# EAGLE design NuTube_Screamer_v1_1 (EAGLE 6.3)

## Sheet 1 of 2
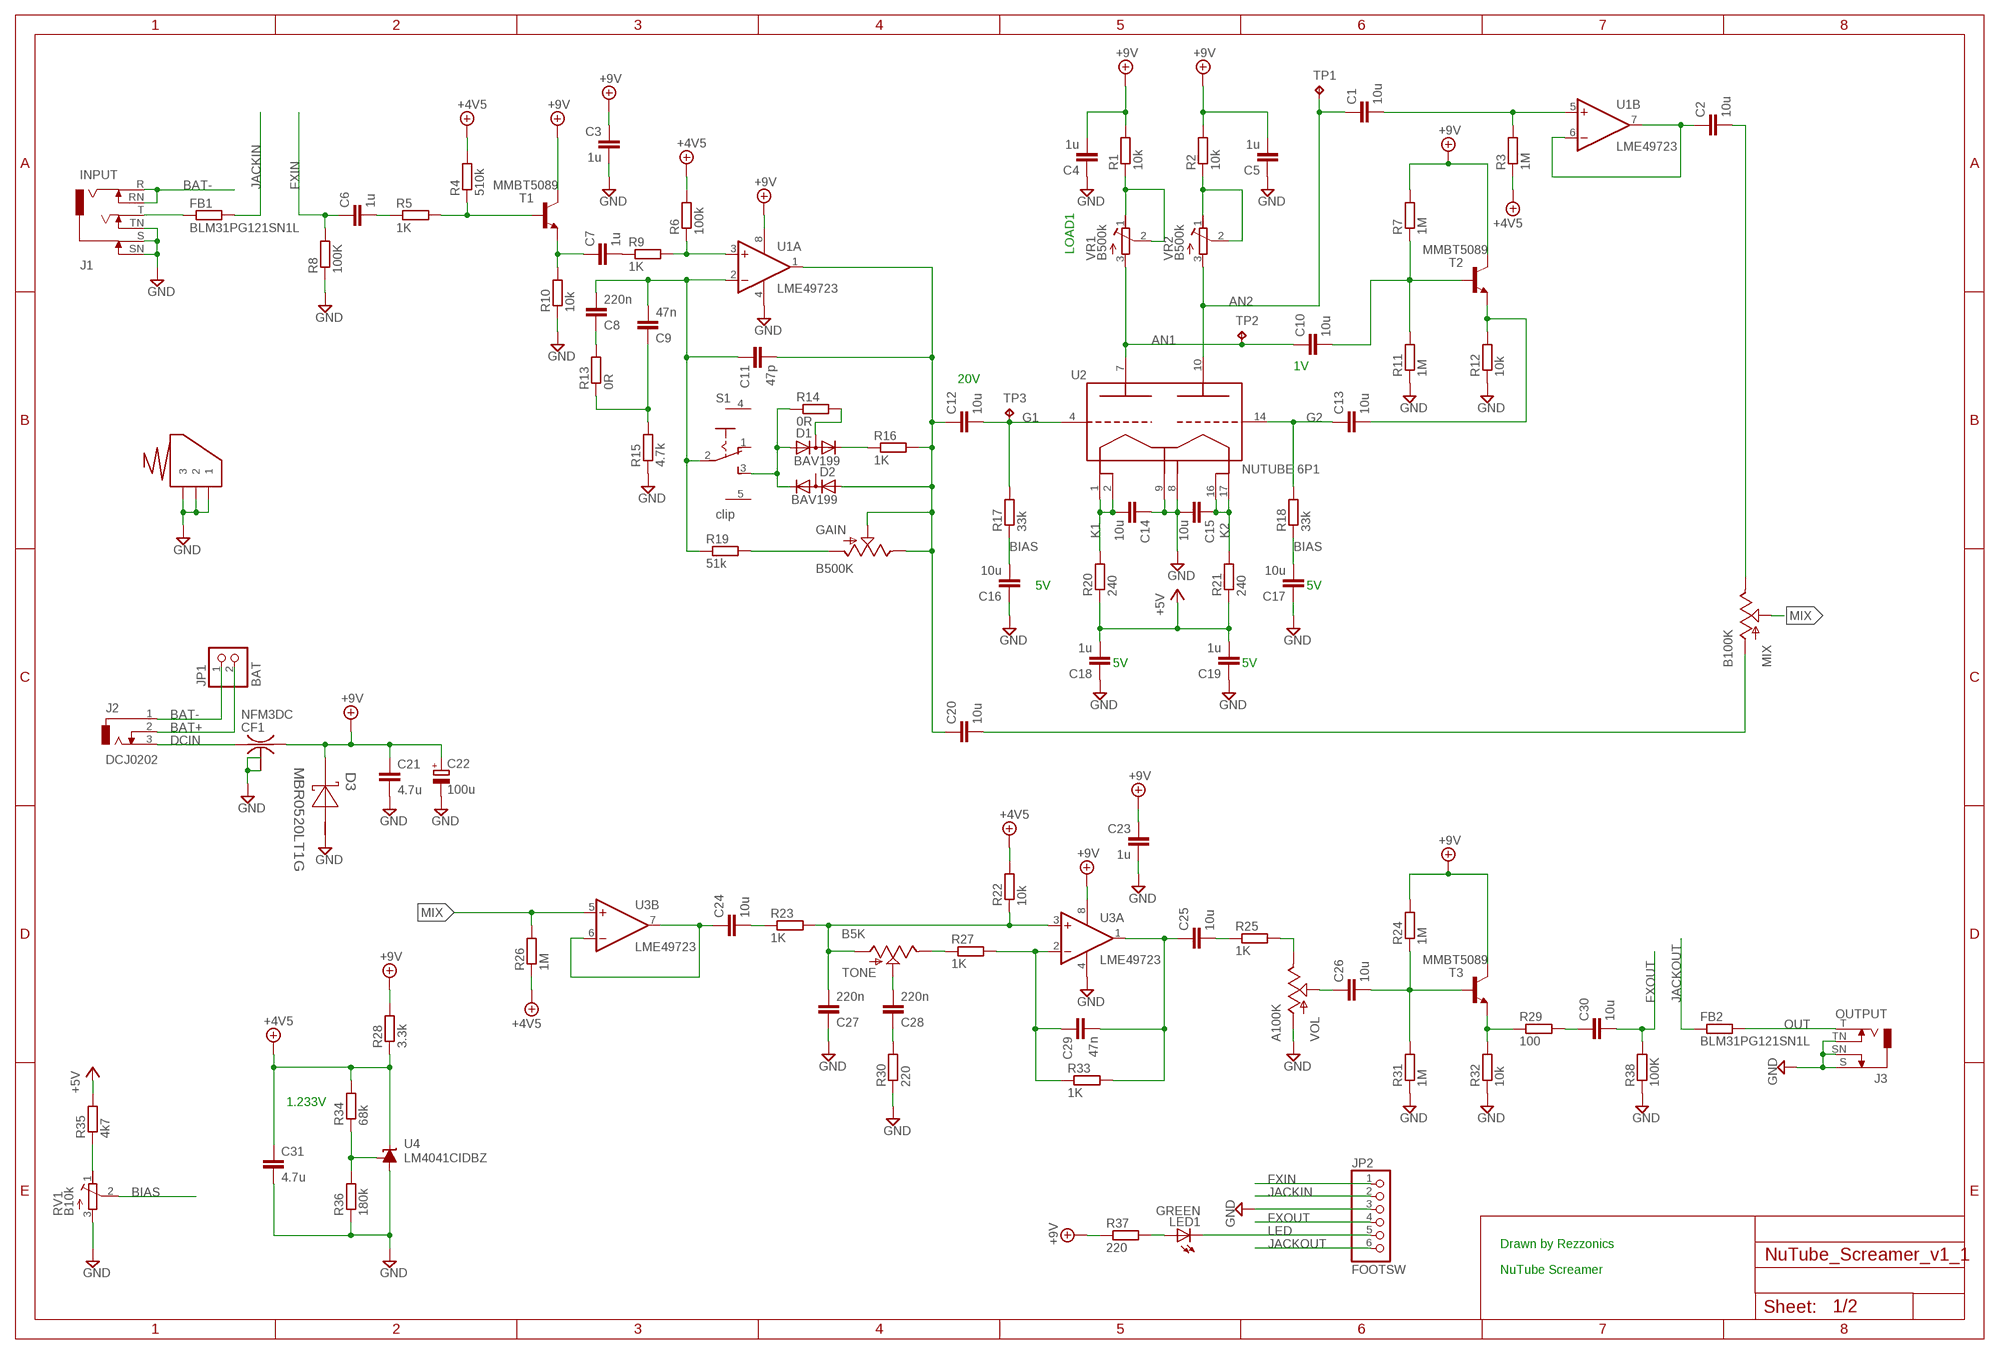
[diagram p0: schematic, sheet 1]

### Parts
C1  10u  C-EUC0805K  [C0805K]
C2  10u  C-EUC0805K  [C0805K]
C3  1u  C-EUC0603K  [C0603K]
C4  1u  C-EUC0603K  [C0603K]
C5  1u  C-EUC0603K  [C0603K]
C6  1u  C-EUC0603K  [C0603K]
C7  1u  C-EUC0603K  [C0603K]
C8  220n  C-EUC0603K  [C0603K]
C9  47n  C-EUC0603K  [C0603K]
C10  10u  C-EUC0805K  [C0805K]
C11  47p  C-EUC0603K  [C0603K]
C12  10u  C-EUC0805K  [C0805K]
C13  10u  C-EUC0805K  [C0805K]
C14  10u  C-EUC0805K  [C0805K]
C15  10u  C-EUC0805K  [C0805K]
C16  10u  C-EUC0805K  [C0805K]
C17  10u  C-EUC0805K  [C0805K]
C18  1u  C-EUC0603K  [C0603K]
C19  1u  C-EUC0603K  [C0603K]
C20  10u  C-EUC0805K  [C0805K]
C21  4.7u  C-EUC0805K  [C0805K]
C22  100u  CPOL-EUD  [PANASONIC_D]
C23  1u  C-EUC0603K  [C0603K]
C24  10u  C-EUC0805K  [C0805K]
C25  10u  C-EUC0805K  [C0805K]
C26  10u  C-EUC0805K  [C0805K]
C27  220n  C-EUC0603K  [C0603K]
C28  220n  C-EUC0603K  [C0603K]
C29  47n  C-EUC0603K  [C0603K]
C30  10u  C-EUC0805K  [C0805K]
C31  4.7u  C-EUC0805K  [C0805K]
CF1  NFM3DC  [NFM3DC]
D1  BAV199  [SOT23]
D2  BAV199  [SOT23]
D3  MBR0520LT1G  MBR0540T1G  [SOD-123]
FB1  BLM31PG121SN1L  R-EU_R1206  [R1206]
FB2  BLM31PG121SN1L  R-EU_R1206  [R1206]
GAIN  B500K  POT  [ALPS_POT]
J1  INPUT  STEREOSW3C  [NEUTRIK-NMJ6HCD2]
J2  DCJ0202  [DCJ0202]
J3  OUTPUT  MONOSW3C  [NEUTRIK-NMJ4HCD2]
JP1  BAT  PINHD-1X2  [1X02]
JP2  FOOTSW  PINHD-1X6  [1X06]
LED1  GREEN  LED5MM  [LED5MM]
MIX  B100K  POT  [ALPS_POT]
R1  10k  R-EU_R0603  [R0603]
R2  10k  R-EU_R0603  [R0603]
R3  1M  R-EU_R0603  [R0603@1]
R4  510k  R-EU_R0603  [R0603@1]
R5  1K  R-EU_R0603  [R0603@1]
R6  100k  R-EU_R0603  [R0603@1]
R7  1M  R-EU_R0603  [R0603@1]
R8  100K  R-EU_R0603  [R0603@1]
R9  1K  R-EU_R0603  [R0603@1]
R10  10k  R-EU_R0603  [R0603@1]
R11  1M  R-EU_R0603  [R0603@1]
R12  10k  R-EU_R0603  [R0603@1]
R13  0R  R-EU_R0603  [R0603@1]
R14  0R  R-EU_R0603  [R0603@1]
R15  4.7k  R-EU_R0603  [R0603@1]
R16  1K  R-EU_R0603  [R0603@1]
R17  33k  R-EU_R0603  [R0603]
R18  33k  R-EU_R0603  [R0603]
R19  51k  R-EU_R0603  [R0603@1]
R20  240  R-EU_R0603  [R0603]
R21  240  R-EU_R0603  [R0603]
R22  10k  R-EU_R0603  [R0603@1]
R23  1K  R-EU_R0603  [R0603@1]
R24  1M  R-EU_R0603  [R0603@1]
R25  1K  R-EU_R0603  [R0603@1]
R26  1M  R-EU_R0603  [R0603@1]
R27  1K  R-EU_R0603  [R0603@1]
R28  3.3k  R-EU_R0603  [R0603@1]
R29  100  R-EU_R0603  [R0603@1]
R30  220  R-EU_R0603  [R0603@1]
R31  1M  R-EU_R0603  [R0603@1]
R32  10k  R-EU_R0603  [R0603@1]
R33  1K  R-EU_R0603  [R0603@1]
R34  68k  R-EU_R0603  [R0603@1]
R35  4k7  R-EU_R0603  [R0603]
R36  180k  R-EU_R0603  [R0603@1]
R37  220  R-EU_R0603  [R0603@1]
R38  100K  R-EU_R0603  [R0603@1]
RV1  B10k  R-TRIMM3314G  [RTRIM3314G]
S1  clip  SPDT  [MHS122K]
T1  MMBT5089  MMBT2222ALT1-NPN-SOT23-BEC  [SOT23-BEC]
T2  MMBT5089  MMBT2222ALT1-NPN-SOT23-BEC  [SOT23-BEC]
T3  MMBT5089  MMBT2222ALT1-NPN-SOT23-BEC  [SOT23-BEC]
TONE  B5K  POT  [ALPS_POT]
TP1  TPTP10R  [TP10R]
TP2  TPTP10R  [TP10R]
TP3  TPTP10R  [TP10R]
U1  LME49723  RC4559D  [SO08]
U2  NUTUBE 6P1  NUTUBE_6P1_1  [NUTUBE_6P1_1]
U3  LME49723  RC4559D  [SO08]
U4  LM4041CIDBZ  [DBZ_R-PDSO-G3]
VOL  A100K  POT  [ALPS_POT]
VR1  B500k  R-TRIMM3314G  [RTRIM3314G]
VR2  B500k  R-TRIMM3314G  [RTRIM3314G]
X1  CLIPAAA-CLIPAAA_2  [CLIPAAA_2]

### Nets
+4.5V [PWR]: C31.1 R3.1 R4.2 R6.2 R22.2 R26.1 R28.1 R34.2 U4.2(C) ; supply symbol labelled +4V5
+5V [PWR]: C18.2 C19.2 R20.1 R21.1 R35.2 ; also sheet 2
+9V [PWR]: C3.1 C4.2 C5.2 C21.1 C22.+ C23.1 CF1.3 D3.1(K) R1.2 R2.2 R7.2 R24.2 R28.2 R37.1 T1.C T2.C T3.C U1.8(P:V+) U3.8(P:V+) ; also sheet 2
AN1: C10.1 TP2.TP U2.7(A1_7) VR1.3(A)
AN2: C1.1 TP1.TP U2.10(A2_10) VR2.3(A)
BAT+ [PWR]: J2.2 JP1.2
BAT- [PWR]: J1.R J1.RN J2.1 JP1.1
BIAS: C16.2 C17.2 R17.1 R18.1 RV1.2(S)
DCIN [PWR]: CF1.1 J2.3
FXIN: C6.1 JP2.1 R8.2
FXOUT: C30.2 JP2.4 R38.2
G1: C12.2 R17.2 TP3.TP U2.4(G1_4)
G2: C13.1 R18.2 U2.14(G2_14)
GND [PWR]: C3.2 C4.1 C5.1 C14.1 C15.2 C16.1 C17.1 C18.1 C19.1 C21.2 C22.- C23.2 C27.1 C31.2 CF1.2@1 CF1.2@2 D3.2(A) J1.S J1.SN J1.TN J3.S J3.SN J3.TN JP2.3 R8.1 R10.1 R11.1 R12.1 R15.1 R30.1 R31.1 R32.1 R36.1 R38.1 RV1.3(A) U1.4(P:V-) U2.8(GND_8) U2.9(F2_9) U3.4(P:V-) U4.3(A) VOL.P$1(A) X1.1 X1.2 X1.3 ; also sheet 2
JACKIN: FB1.2 JP2.2
JACKOUT: FB2.1 JP2.6
K1: C14.2 R20.2 U2.1(F1_1) U2.2(F1_2)
K2: C15.1 R21.2 U2.16(F3_16) U2.17(F3_17)
LED: JP2.5 LED1.K(C)
MIX: MIX.P$2(S) R26.2 U3.5(B:+IN)
N$1: C10.2 R7.1 R11.2 T2.B
N$2: C6.2 R5.1
N$3: C13.2 R12.2 T2.E
N$4: FB1.1 J1.T
N$6: C7.1 R10.2 T1.E
N$7: R4.1 R5.2 T1.B
N$8: C7.2 R9.1
N$9: R6.1 R9.2 U1.3(A:+IN)
N$10: D1.2(C) R16.1
N$11: D1.1(A) D2.2(C) R14.1 S1.3(S)
N$12: D1.3(AC) R14.2
N$13: C11.2 C12.1 C20.1 D2.1(A) GAIN.P$2(S) GAIN.P$3(E) R16.2 U1.1(A:OUT)
N$14: C8.2 C9.2 C11.1 R19.1 S1.2(P) U1.2(A:-IN)
N$17: GAIN.P$1(A) R19.2
N$18: R34.1 R36.2 U4.1(FB)
N$19: LED1.A R37.2
N$20: C8.1 R13.2
N$21: R35.1 RV1.1(E)
N$22: C9.1 R13.1 R15.2
N$24: C1.2 R3.2 U1.5(B:+IN)
N$25: C2.1 U1.6(B:-IN) U1.7(B:OUT)
N$26: C20.2 MIX.P$1(A)
N$27: C2.2 MIX.P$3(E)
N$28: C27.2 R22.1 R23.2 TONE.P$1(A) U3.3(A:+IN)
N$29: C24.1 U3.6(B:-IN) U3.7(B:OUT)
N$30: C24.2 R23.1
N$31: C25.1 C29.2 R33.2 U3.1(A:OUT)
N$32: R27.1 TONE.P$3(E)
N$33: C28.2 TONE.P$2(S)
N$34: C28.1 R30.2
N$35: C29.1 R27.2 R33.1 U3.2(A:-IN)
N$36: C25.2 R25.1
N$37: R25.2 VOL.P$3(E)
N$38: C26.1 VOL.P$2(S)
N$39: C26.2 R24.1 R31.2 T3.B
N$40: R29.1 R32.2 T3.E
N$41: C30.1 R29.2
OUT: FB2.2 J3.T
RL1: R1.1 VR1.1(E) VR1.2(S)
RL2: R2.1 VR2.1(E) VR2.2(S)
Unconnected: D2.3(AC) S1.1(O) S1.4(G1) S1.5(G2)

### Notes on the sheet
- LOAD1
- 1V
- 20V
- 5V | 5V
- 5V | 5V
- 1.233V
- Drawn by Rezzonics
- NuTube Screamer

## Sheet 2 of 2
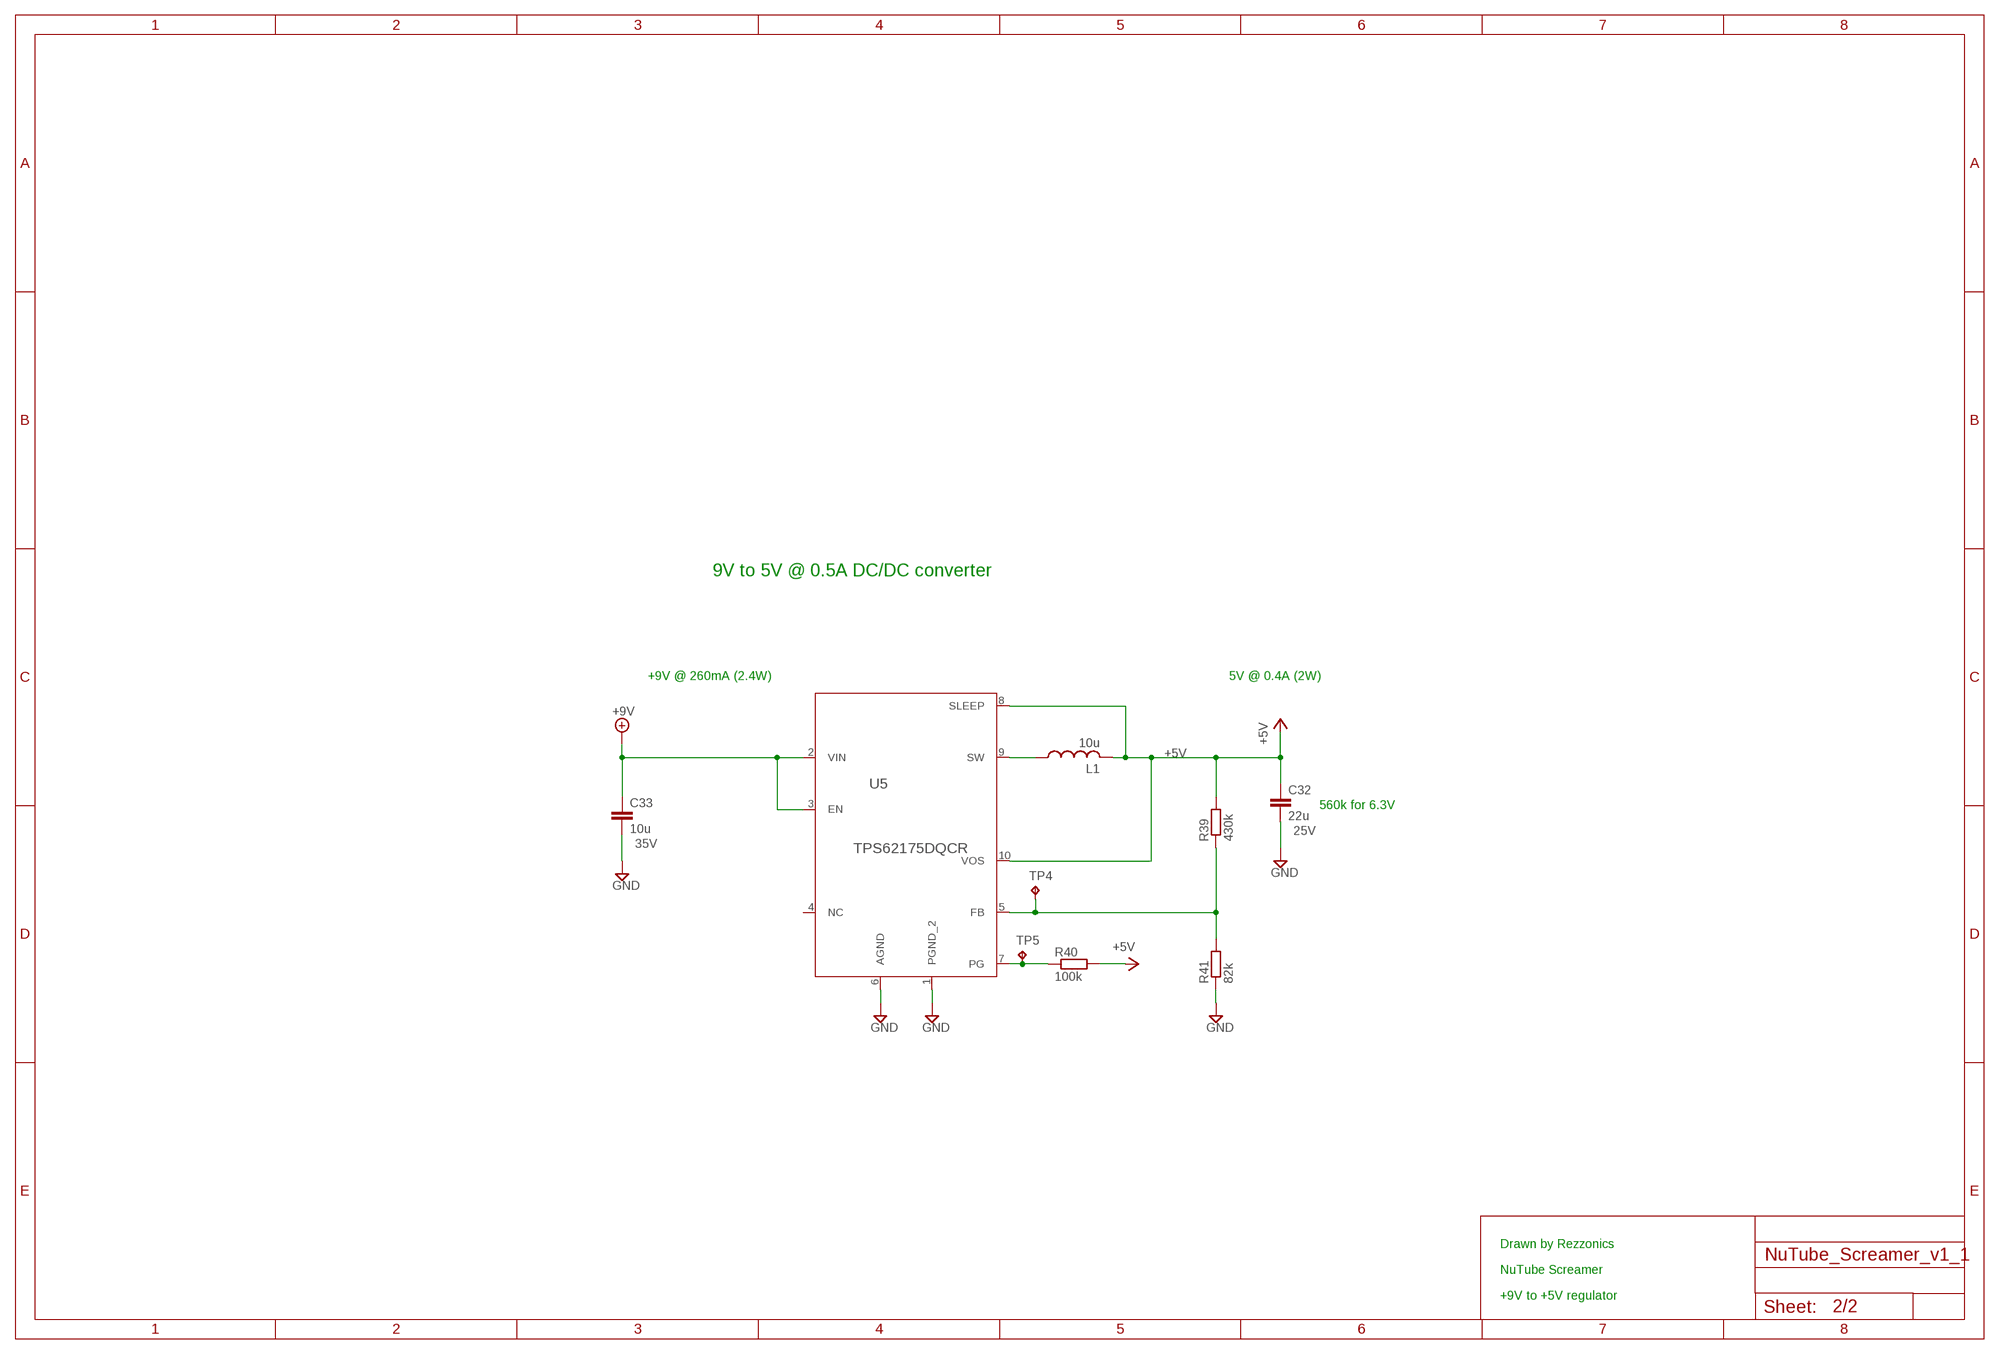
[diagram p1: schematic, sheet 2]

### Parts
C32  22u  C-EUC0805K  [C0805K]
C33  10u  C-EUC0805K  [C0805K]
L1  10u  SRN4018  [SRN4018]
R39  430k  R-EU_R0603  [R0603]
R40  100k  R-EU_R0603  [R0603]
R41  82k  R-EU_R0603  [R0603]
TP4  TPTP10R  [TP10R]
TP5  TPTP10R  [TP10R]
U5  TPS62175DQCR  [R-PWSON-N10]

### Nets
+5V [PWR]: C32.1 L1.2 R39.2 R40.2 U5.8(SLEEP) U5.10(VOS) ; also sheet 1
+9V [PWR]: C33.1 U5.2(VIN) U5.3(EN) ; also sheet 1
GND [PWR]: C32.2 C33.2 R41.1 U5.1(PGND_2) U5.6(AGND) ; also sheet 1
N$15: R40.1 TP5.TP U5.7(PG)
N$23 [PWR]: L1.1 U5.9(SW)
VCC3: R39.1 R41.2 TP4.TP U5.5(FB)
Unconnected: U5.4(NC)

### Notes on the sheet
- 9V to 5V @ 0.5A DC/DC converter
- +9V @ 260mA (2.4W) | 5V @ 0.4A (2W)
- 560k for 6.3V
- Drawn by Rezzonics
- NuTube Screamer
- +9V to +5V regulator

## Library data of the parts
C1 C2 C10 C12 C14-C17 C20 C24-C26 C30 = rcl:C-EU: CAPACITOR, European symbol; MPN: GRM21BR6YA106KE43L; PARTNO: GRM21BR6YA106KE43L
C3 C6 C7 C23 = rcl:C-EU: CAPACITOR, European symbol; MPN: GRM188R71H104KA93D; PARTNO: C1608X7R1V105K080AE
C4 C5 C18 C19 = rcl:C-EU: CAPACITOR, European symbol; MPN: C1608X5R1H105K080AB; PARTNO: C1608X7R1V105K080AE
C8 C27 C28 = rcl:C-EU: CAPACITOR, European symbol; MPN: GRM188R71H104KA93D; PARTNO: GRM188R61H224KAC4D
C9 C29 = rcl:C-EU: CAPACITOR, European symbol; MPN: GRM188R71H104KA93D; PARTNO: 06035D473MAT2A
C11 = rcl:C-EU: CAPACITOR, European symbol; MPN: GRM188R71H104KA93D; PARTNO: GCM1885C2A470JA16D
C13 = rcl:C-EU: CAPACITOR, European symbol; PARTNO: GRM21BR6YA106KE43L
C21 C31 = rcl:C-EU: CAPACITOR, European symbol; MPN: GRM21BR61E475KA12L; PARTNO: C2012X5R1E475K125AB
C22 = rcl:CPOL-EU: POLARIZED CAPACITOR, European symbol; MPN: EEE-1VA101XP; PARTNO: EEE-1VA101XP
C32 = rcl:C-EU: CAPACITOR, European symbol; MPN: C2012X5R1V226M125AC; PARTNO: C2012X5R1V226M125AC; VOLT: 25V
C33 = rcl:C-EU: CAPACITOR, European symbol; MPN: GRM21BR6YA106KE43L; PARTNO: GRM21BR6YA106KE43L; VOLT: 35V
CF1 = murata-filter:NFM: EMIFIL(R) (Capacitor type) Single Circuit Type for Signal Lines Source: http://search.murata.co.jp/Ceramy/image/img/PDF/ENG/L0111S0109NFM3DC.pdf; MF: FARNELL; MPN: NFM3DPC223R1H3L; OC_FARNELL: 9528288; OC_NEWARK: 38K6023; PARTNO: NFM3DPC223R1H3L
D1 D2 = diode:BAV199: DIODE low-leakage double diode; PARTNO: BAV199235
D3 = rezzonics:MBR0540T1G; DATASHEETURL: http://www.onsemi.com/pub%5Flink/Collateral/MBR0540T1%2DD.PDF; IO: 0.5; MANUFACTURER_NAME: ON Semiconductor; MANUFACTURER_PART_NUMBER: MBR0540T1G; MPN: MBR0520LT1G; PARTNO: MBR0520LT1G; VENDOR: ON Semiconductor; VFATIO: 0.51; VRRM: 40.0
FB1 FB2 = rcl:R-EU_: RESISTOR, European symbol; MPN: BLM31PG121SN1L; PARTNO: BLM31PG121SN1L
GAIN = rezzonics:POT; PARTNO: PTV09A-4020S-B504
J1 = audio jacks 0.25 inch:STEREOSW3C: 1/4" stereo jack, switched, with chrome ferrule and straight PCB pins, mounting nut included; MPN: NMJ6HCD2; PARTNO: NMJ6HCD2
J2 = con-jack:DCJ0202: DC POWER JACK Source: DCJ0202.pdf; MPN: 163-179PH-EX; OC_FARNELL: unknown; OC_NEWARK: unknown; PARTNO: PJ-202A
J3 = audio jacks 0.25 inch:MONOSW3C: 1/4" mono jack, switched, with chrome ferrule and straight PCB pins, mounting nut included; MPN: NMJ4HCD2; PARTNO: NMJ4HCD2
JP1 = pinhead:PINHD-1X2: PIN HEADER; MPN: *; PARTNO: *
JP2 = pinhead:PINHD-1X6: PIN HEADER; MPN: *; PARTNO: *
L1 = rezzonics:SRN4018: SRN4018 <http://www.bourns.com/docs/Product-Datasheets/SRN4018.pdf>; MPN: SRN4018-100M; PARTNO: SRN4018-100M
LED1 = led:LED: LED OSRAM: - CHIPLED LG R971, LG N971, LY N971, LG Q971, LY Q971, LO R971, LY R971 LH N974, LH R974 LS Q976, LO Q976, LY Q976 LO Q996 - Hyper CHIPLED LW Q18S LB Q993, LB Q99A, LB R99A - SideLED LS A670, LO A670, LY A670, LG A670, LP A670 LB A673, LV A673, LT A673, LW A673 LH A674 LY A675 LS A676, LA A676, LO A676, LY A676, LW A676 LS A679, LY A679, LG A679 - Hyper Micro SIDELED® LS Y876, LA Y876, LO Y876, LY Y876 LT Y87S - SmartLED LW L88C, LW L88S LB L89C, LB L89S, LG L890 LS L89K, LO L89K, LY L89K LS L896, LA L896, LO L896, LY L896 - TOPLED LS T670, LO T670, LY T670, LG T670, LP T670 LSG T670, LSP T670, LSY T670, LOP T670, LYG T670 LG T671, LOG T671, LSG T671 LB T673, LV T673, LT T673, LW T673 LH T674 LS T676, LA T676, LO T676, LY T676, LB T676, LH T676, LSB T676, LW T676 LB T67C, LV T67C, LT T67C, LS T67K, LO T67K, LY T67K, LW E67C LS E67B, LA E67B, LO E67B, LY E67B, LB E67C, LV E67C, LT E67C LW T67C LS T679, LY T679, LG T679 LS T770, LO T770, LY T770, LG T770, LP T770 LB T773, LV T773, LT T773, LW T773 LH T774 LS E675, LA E675, LY E675, LS T675 LS T776, LA T776, LO T776, LY T776, LB T776 LHGB T686 LT T68C, LB T68C - Hyper Mini TOPLED® LB M676 - Mini TOPLED Santana® LG M470 LS M47K, LO M47K, LY M47K Source: http://www.osram.convergy.de LUXEON: - LUMILED® LXK2-PW12-R00, LXK2-PW12-S00, LXK2-PW14-U00, LXK2-PW14-V00 LXK2-PM12-R00, LXK2-PM12-S00, LXK2-PM14-U00 LXK2-PE12-Q00, LXK2-PE12-R00, LXK2-PE12-S00, LXK2-PE14-T00, LXK2-PE14-U00 LXK2-PB12-K00, LXK2-PB12-L00, LXK2-PB12-M00, LXK2-PB14-N00, LXK2-PB14-P00, LXK2-PB14-Q00 LXK2-PR12-L00, LXK2-PR12-M00, LXK2-PR14-Q00, LXK2-PR14-R00 LXK2-PD12-Q00, LXK2-PD12-R00, LXK2-PD12-S00 LXK2-PH12-R00, LXK2-PH12-S00 LXK2-PL12-P00, LXK2-PL12-Q00, LXK2-PL12-R00 Source: www.luxeon.com KINGBRIGHT: KA-3528ASYC Source: www.kingbright.com; MPN: SSL-LX5093GD; PARTNO: SSL-LX5093GD
MIX = rezzonics:POT; PARTNO: PTV09A-4020S-B104
R1 R2 = resistor:R-EU_: RESISTOR, European symbol; MPN: ERJ-2RKF1002X; PARTNO: CR0603-FX-1002HLF
R3 R7 R8 R11 R24 R26 R31 R38 = rcl:R-EU_: RESISTOR, European symbol; MPN: CR0603-FX-1004ELF; PARTNO: CR0603-FX-1004ELF
R4 = rcl:R-EU_: RESISTOR, European symbol; MPN: CR0603-FX-1004ELF; PARTNO: CR0603-FX-5103ELF
R5 R9 R16 R23 R25 R27 R33 = rcl:R-EU_: RESISTOR, European symbol; MPN: CR0603-FX-1002HLF; PARTNO: ERJ-3EKF1001V
R6 = rcl:R-EU_: RESISTOR, European symbol; MPN: CR0603-FX-1004ELF; PARTNO: ERJ-3EKF1003V
R10 R12 R22 R32 = rcl:R-EU_: RESISTOR, European symbol; MPN: CR0603-FX-1004ELF; PARTNO: CR0603-FX-1002HLF
R13 R14 = rcl:R-EU_: RESISTOR, European symbol; MPN: CR0603-FX-1002HLF; PARTNO: CRCW06030000ZSTB
R15 = rcl:R-EU_: RESISTOR, European symbol; MPN: CR0603-FX-1004ELF; PARTNO: ERJ-3EKF4701V
R17 R18 = resistor:R-EU_: RESISTOR, European symbol; MPN: ERJ-2RKF3302X; PARTNO: CR0603-FX-3302ELF
R19 = rcl:R-EU_: RESISTOR, European symbol; MPN: CR0603-FX-1002HLF; PARTNO: ERJ-3EKF5102V
R20 R21 = resistor:R-EU_: RESISTOR, European symbol; MPN: ERJ-3EKF2400V; PARTNO: ERJ-3EKF2400V
R28 = rcl:R-EU_: RESISTOR, European symbol; MPN: RC0603FR-073K3L; PARTNO: RC0603FR-073K3L
R29 = rcl:R-EU_: RESISTOR, European symbol; MPN: CR0603-FX-1002HLF; PARTNO: RC0603FR-07100RL
R30 = rcl:R-EU_: RESISTOR, European symbol; MPN: CR0603-FX-1004ELF; PARTNO: ERJ-PA3F2200V
R34 = rcl:R-EU_: RESISTOR, European symbol; MPN: RC0603FR-0768KL; PARTNO: RC0603FR-0768KL
R35 = resistor:R-EU_: RESISTOR, European symbol; MPN: ERJ-2RKF4701X; PARTNO: ERJ-3EKF4701V
R36 = rcl:R-EU_: RESISTOR, European symbol; MPN: RC0603FR-07180KL; PARTNO: RC0603FR-07180KL
R37 = rcl:R-EU_: RESISTOR, European symbol; MPN: ERJ-PA3F2200V; PARTNO: ERJ-PA3F2200V
R39 = resistor:R-EU_: RESISTOR, European symbol; MPN: ERJ-2GEJ434X; PARTNO: CR0603-FX-4303ELF
R40 = resistor:R-EU_: RESISTOR, European symbol; MPN: ERJ-2RKF1003X; PARTNO: ERJ-3EKF1003V
R41 = resistor:R-EU_: RESISTOR, European symbol; MPN: ERJ-2RKF8202X; PARTNO: ERJ-3EKF8202V
RV1 = rcl:R-TRIMM: Trimm resistor; MPN: 3314G-2-103E; PARTNO: 3314G-2-103E
S1 = rezzonics:SPDT: SPDT SLIDING SWITCH 4mm spacing through hole, vertical SPDT slide switch APEM MHS122K <http://www.apem.com/files/apem/brochures/MHS_MINI_SLIDE.pdf>; PARTNO: MHS122K
T1-T3 = transistor-neu-to92:*-NPN-: NPN Transistror; PARTNO: MMBT5089
TONE = rezzonics:POT; PARTNO: PTV09A-4020F-B502
TP1-TP5 = testpad:TP: Test pad; MPN: *; PARTNO: 1249
U1 U3 = linear:RC4559: OP AMP; MPN: LME49723MA/NOPB; PARTNO: LME49723MA/NOPB
U2 = rezzonics:NUTUBE_6P1: NUTUBE 6P1 Twin Triode Datasheet <http://nutube.us/downloads/Nutube_Datasheet_31.pdf>; MPN: *; PARTNO: 831-87-032-10-001101
U4 = texas:LM4041*I: PRECISION MICROPOWER SHUNT VOLTAGE REFERENCE Adjustable Output Source: http://focus.ti.com/lit/ds/slcs146e/slcs146e.pdf; MF: TEXAS INSTRUMENT CONNECTORS; MPN: LM4041CIDBZR; OC_FARNELL: unknown; OC_NEWARK: 31K7136; PARTNO: LM4041CIDBZR
U5 = rezzonics:TPS62175DQCR; DATASHEETURL: httpwww.ti.comproducttps62175; FREQUENCY: 1000000.0; IMAX: 0.5; MANUFACTURER_NAME: Texas Instruments; MANUFACTURER_PART_NUMBER: TPS62175DQCR; MKTG_PACKAGE: TPS62175; MPN: TPS62175DQCR; NSID: TPS62175DQCR; PACKAGE: TPS62175; PARTNO: TPS62175DQCR; VENDOR: Texas Instruments
VOL = rezzonics:POT; PARTNO: PTV09A-4020S-A104
VR1 VR2 = rcl:R-TRIMM: Trimm resistor; MPN: 3314G-1-504E; PARTNO: 3314G-1-504E
X1 = battery:CLIPAAA-: Clip battery AAA Negative Spring Keystone 629; MPN: 591; PARTNO: 591

## Net classes
0 default: width 0.25 mm, drill 0.5 mm, clearance 0.25 mm
1 PWR: width 0.25 mm, drill 0.5 mm, clearance 0.25 mm

## Board
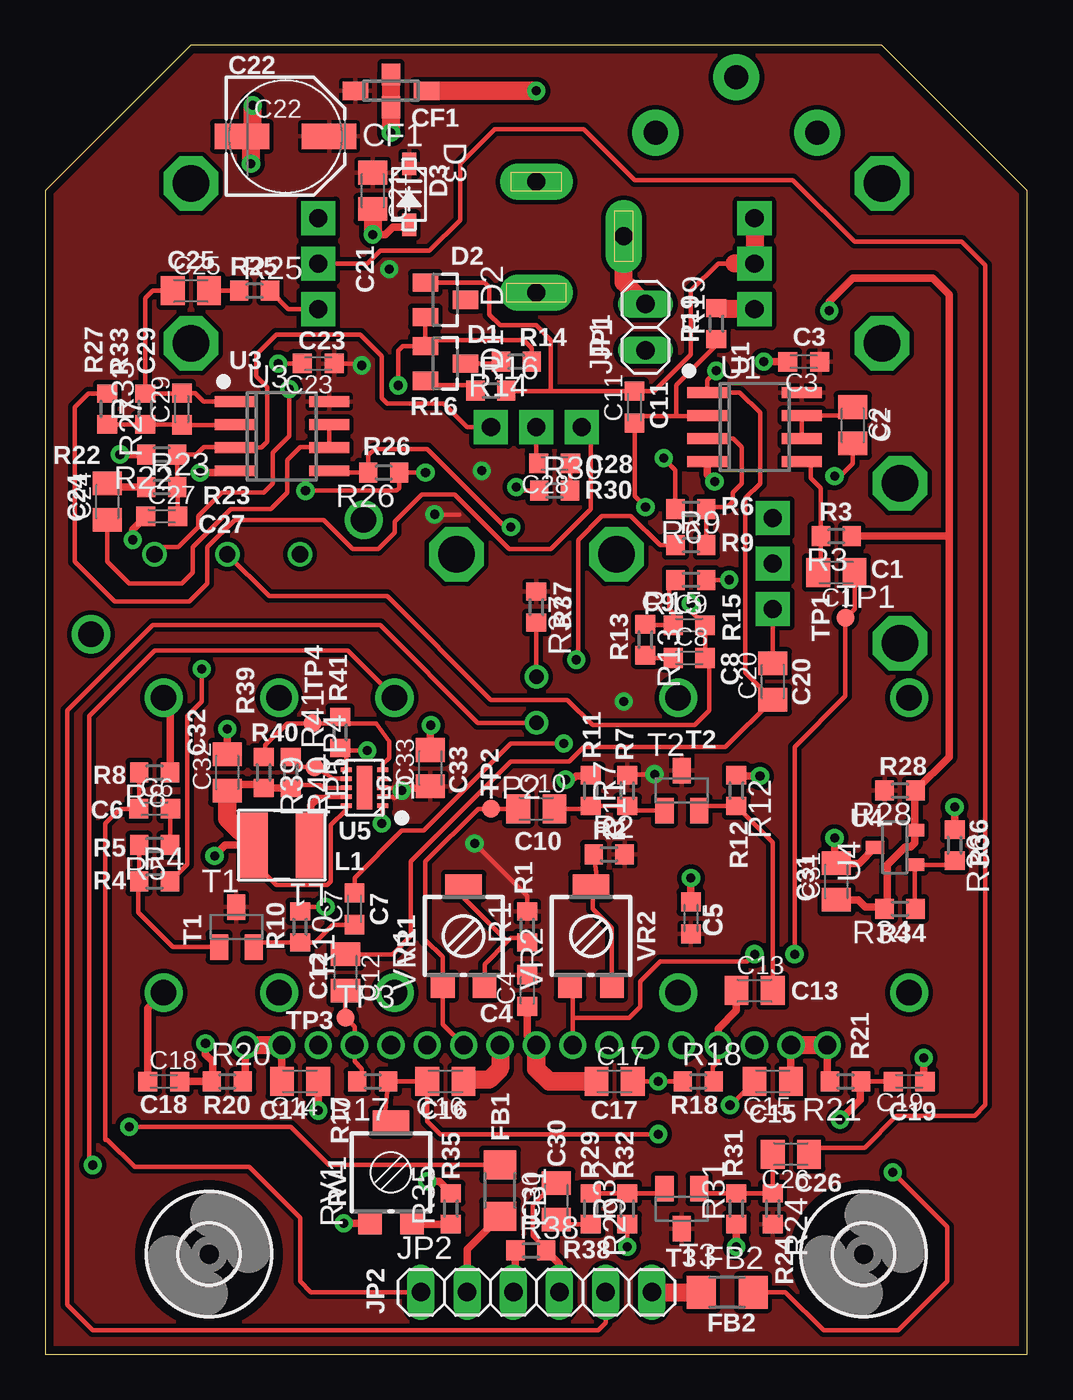
[diagram p2: board, top side]
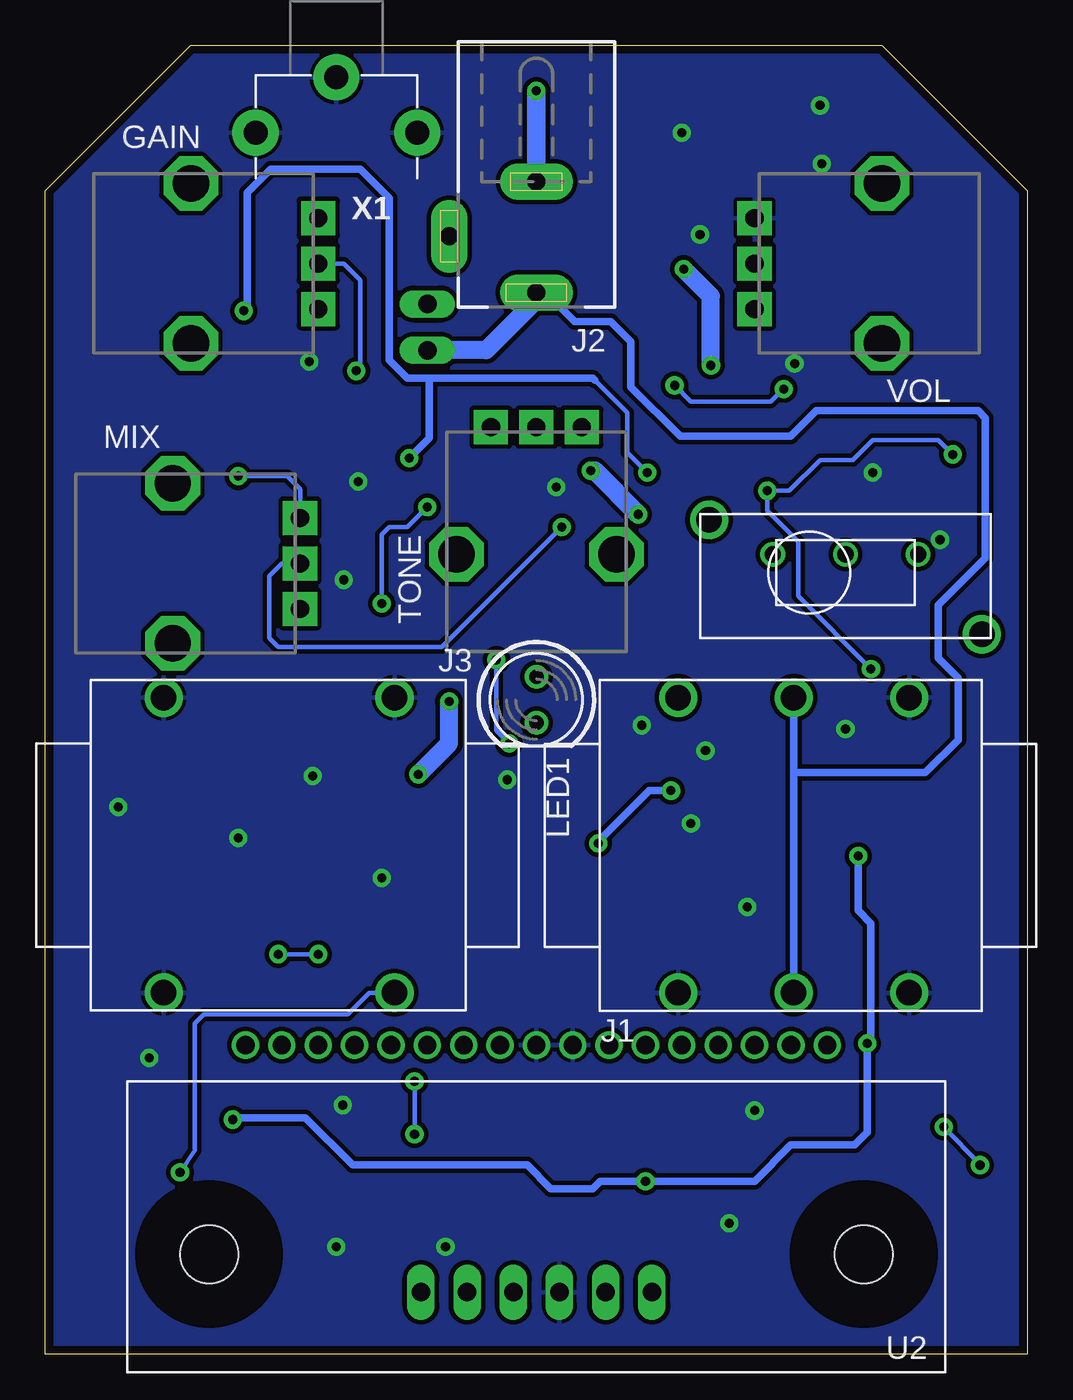
[diagram p3: board, bottom side, seen from below]

Size 54 x 72 mm. Coordinates in mm from the lower left corner, seen from the top.
Outline: 0,0 54,0 54,64 46,72 8,72 0,64 0,0
Copper layers (1*16): Top 0.018mm / dielectric 1.5mm / Bottom 0.018mm
Design rules "Rezzonics 2-layers": minimum track width 0.25mm, minimum drill 0.5mm, track to track 0.25mm, track to pad 0.2mm, pad to pad 0.25mm, via to via 0.25mm, smd to smd 8mil, copper to edge 0.45mm, drill to drill 0.3mm, minimum pad ring 0.2mm, minimum via ring 0.2mm, stop-mask expansion 4mil, vias tented up to drill 0mil, thermal gap 0.2mm

### Footprints (pad centres in the part's own frame; a part is rotated, then mirrored left to right if it is on the bottom)
C0805K = smd 1.3 x 1.6: 1 -1,0; 2 1,0
C0603K = smd 1.05 x 1.08: 1 -0.875,0; 2 0.875,0
PANASONIC_D = smd 3 x 1.4: + 2.4,0; - -2.4,0
NFM3DC = smd 1.4 x 1: 1 -1.95,0; 3 1.95,0 | smd 1 x 1.2: 2@1 0,-0.9; 2@2 0,0.9
SOT23 = smd 1 x 1.4: 1 -0.95,-1.1; 2 0.95,-1.1; 3 0,1.1
SOD-123 = smd 1.219 x 0.762: 1 -1.676,0; 2 1.676,0
R1206 = smd 1.6 x 1.803: 1 -1.422,0; 2 1.422,0
ALPS_POT = drill 1 pad 1.88 square: P$1 7,-2.5; P$2 7,0; P$3 7,2.5 | drill 2 octagon: P$4 0,-4.4; P$5 0,4.4
NEUTRIK-NMJ6HCD2 = drill 1.4: R -8.115,-10.35; RN 8.115,-10.35; S -8.115,-4; SN 8.115,-4; T -8.115,-16.7; TN 8.115,-16.7
DCJ0202 = drill 1 pad 2 long: 1 0,3.1; 2 4.8,0; 3 0,-3
NEUTRIK-NMJ4HCD2 = drill 1.4: S -8.115,-4; SN 8.115,-4; T -8.115,-16.7; TN 8.115,-16.7
1X02 = drill 1.016 long: 1 -1.27,0; 2 1.27,0
1X06 = drill 1.016 long: 1 -6.35,0; 2 -3.81,0; 3 -1.27,0; 4 1.27,0; 5 3.81,0; 6 6.35,0
SRN4018 = smd 1.5 x 3.6: 1 -1.525,0; 2 1.525,0
LED5MM = drill 0.8 pad 1.3: A -1.27,0; K 1.27,0
R0603 = smd 1 x 1.1: 1 -0.85,0; 2 0.85,0
R0603@1 = smd 1 x 1.1: 1 -0.85,0; 2 0.85,0
RTRIM3314G = smd 1.3 x 1.3: 1 1.15,-2.75; 3 -1.15,-2.75 | smd 2 x 1.3: 2 0,2.75
MHS122K = drill 0.9: 1 0,0; 2 0,-4; 3 0,-8 | drill 1.4: 4 1.9,3.5; 5 -4.4,-11.5
SOT23-BEC = smd 1 x 1.4: B -0.95,-1.1; C 0,1.1; E 0.95,-1.1
TP10R = smd 1 x 1: TP 0,0
SO08 = smd 0.6 x 2.2: 1 -1.905,-2.6; 2 -0.635,-2.6; 3 0.635,-2.6; 4 1.905,-2.6; 5 1.905,2.6; 6 0.635,2.6; 7 -0.635,2.6; 8 -1.905,2.6
NUTUBE_6P1_1 = drill 1: 1 -16,-4; 2 -14,-4; 3 -12,-4; 4 -10,-4; 5 -8,-4; 6 -6,-4; 7 -4,-4; 8 -2,-4; 9 0,-4; 10 2,-4; 11 4,-4; 12 6,-4; 13 8,-4; 14 10,-4; 15 12,-4; 16 14,-4; 17 16,-4
DBZ_R-PDSO-G3 = smd 0.7 x 1: 1 -0.95,-1.1; 2 0.95,-1.1; 3 0,1.1
R-PWSON-N10 = smd 0.61 x 0.254: 1 -1.003,1; 2 -1.003,0.5; 3 -1.003,0; 4 -1.003,-0.5; 5 -1.003,-1; 6 1.003,-1; 7 1.003,-0.5; 8 1.003,0; 9 1.003,0.5; 10 1.003,1 | smd 0.838 x 2.388: 11 0,0
3,2 = hole 3.2: 0,0
CLIPAAA_2 = drill 1.32 pad 2.54: 1 0,-3.05; 2 4.445,0; 3 -4.445,0

### Placement (x,y rotation side)
C1  43.5,43 180 top
C2  44.4,51.1 270 top
C3  41.7,54.6 180 top
C4  26.5,20 90 top
C5  35.5,24 270 top
C6  6,30 0 top
C7  17,24.5 90 top
C8  35.4,38.3 0 top
C9  35.4,40.1 0 top
C10  27,30 0 top
C11  32.4,52.1 90 top
C12  16.5,21 270 top
C13  39,20 0 top
C14  14,15 180 top
C15  40,15 180 top
C16  22,15 180 top
C17  31.3,15 0 top
C18  6.5,15 0 top
C19  47.5,15 180 top
C20  40,37 90 top
C21  18,64 270 top
C22  13.2,67 0 top
C23  15,54.5 180 top
C24  3.4,46.9 90 top
C25  8,58.5 0 top
C26  41,11 180 top
C27  6.4,46.1 0 top
C28  28,49 180 top
C29  7.5,52 90 top
C30  28.1,8.4 90 top
C31  43.5,26 90 top
C32  10,32 90 top
C33  21.17,32.24 90 top
CF1  19,69.5 180 top
D1  22,54.5 270 top
D2  22,58 270 top
D3  20,63.8 270 top
FB1  25,9 270 top
FB2  37.5,3.4 0 top
GAIN  46,60 0 bottom
J1  2.5,28 270 bottom
J2  27,61.5 180 bottom
J3  51.5,28 90 bottom
JP1  33,56.5 90 top
JP2  27,3.4 0 top
L1  13,28 180 top
LED1  27,36 270 bottom
MIX  47,43.5 0 bottom
R1  26.5,23.5 90 top
R2  31,27.5 0 top
R3  1M  [R0603]  43.5,45 180 top
R4  510k  [R0603]  6,26 0 top
R5  1K  [R0603]  6,28 180 top
R6  100k  [R0603]  35.5,46.5 180 top
R7  1M  [R0603]  32,31 90 top
R8  100K  [R0603]  6,32 180 top
R9  1K  [R0603]  35.5,44.5 0 top
R10  10k  [R0603]  14,23.5 270 top
R11  1M  [R0603]  30,31 270 top
R12  10k  [R0603]  38,31 270 top
R13  0R  [R0603]  33,39.3 270 top
R14  0R  [R0603]  25.9,54.6 180 top
R15  4.7k  [R0603]  35.5,42.6 180 top
R16  1K  [R0603]  24.5,53 0 top
R17  18,15 180 top
R18  35.9,15 0 top
R19  51k  [R0603]  36.9,56.7 90 top
R20  10,15 0 top
R21  44,15 180 top
R22  10k  [R0603]  6.4,49.5 180 top
R23  1K  [R0603]  6.4,47.7 0 top
R24  1M  [R0603]  40,8 270 top
R25  1K  [R0603]  11.5,58.5 0 top
R26  1M  [R0603]  18.6,48.5 180 top
R27  1K  [R0603]  3.4,52 270 top
R28  3.3k  [R0603]  47,31 180 top
R29  100  [R0603]  30,8 270 top
R30  220  [R0603]  28,47.5 0 top
R31  1M  [R0603]  38,8 90 top
R32  10k  [R0603]  32,8 90 top
R33  1K  [R0603]  5.5,52 90 top
R34  68k  [R0603]  47,24.5 180 top
R35  22.3,8 90 top
R36  180k  [R0603]  50,28 270 top
R37  220  [R0603]  27,41.1 270 top
R38  26.7,5.7 0 top
R39  12,32 270 top
R40  13.5,32 270 top
R41  16.2,34.2 90 top
RV1  19,10 0 top
S1  14,44 90 bottom
T1  10.5,23.5 0 top
T2  35,31 0 top
T3  35,8 180 top
TONE  27,44 90 bottom
TP1  44,40.5 0 top
TP2  24.5,30 0 top
TP3  16.5,18.5 0 top
TP4  14.7,34.7 270 top
TP5  14.8,32.3 270 top
U1  39,51 270 top
U2  27,13 180 bottom
U3  13,50.5 270 top
U4  46.72,27.87 90 top
U5  17.55,31.16 180 top
U$1  [3,2]  9,5.5 0 top
U$2  [3,2]  45,5.5 0 top
VOL  8,60 180 bottom
VR1  23,23 0 top
VR2  30,23 0 top
X1  38,67.2 180 bottom

### Tracks (layer width: path | path; a pad name or v marks a point on that pad's centre or on a via)
+4.5V  (via drill 0.5 pad 1)
  Top 0.25: v14.3,47.5 19.3,47.5 19.45,47.65 R26.1 v20.9,48.5 | R4.2 7.8,26.95 7.8,35.1 8.6,35.9 v8.6,37.7 | R6.2 34.65,48.65 v34,49.3
  Top 0.4: R34.2 46.05,24.6 | 46.05,24.6 45.1,24.6 44.7,25 C31.1 | 46.05,24.6 46.3,24.85 46.3,26.9 47.3,27.9 47.6,27.9 47.82,28.12 U4.2 47.82,30.97 R28.1 49.7,32.85 49.7,45 | R22.2 v4.1,49.5 | R3.1 49.7,45 | 49.7,45 49.7,58.3 48.8,59.2 44.4,59.2 43.1,57.9 v43.1,57.4
  Bottom 0.25: v4.1,49.5 4.9,50.3 8.5,50.3 9.6,49.2 11.4,49.2 13.1,47.5 v14.3,47.5 14.3,46.4 12.6,44.7 12.6,41.7 v8.6,37.7 | v20.9,48.5 22,49.6 22,51.8 23.8,53.6
  Bottom 0.4: v43.1,57.4 42.9,57.6 42.9,63.9 41.6,65.2 36.7,65.2 35.1,63.6 35.1,54.7 34.1,53.7 32.9,53.7 | 32.9,53.7 32.9,50.4 v34,49.3 | 32.9,53.7 23.9,53.7 23.8,53.6
+5V  (via drill 0.5 pad 1)
  Top 0.25: U5.8 15.24,31.16 15.1,31.3 13.55,31.3 R40.2 | U5.10 16.55,29.95 15.7,29.1 15.7,26 15.5,25.8 12.7,25.8 11.8,26.7 11.8,27.68 L1.2 | R21.1 C19.2
  Top 0.4: C18.2 R20.1 9.2,15.05 9.2,16.1 8.8,16.5 v8.8,17.1 | v43.7,12.9 44.8,14 44.8,14.95 R21.1 | L1.2 9.9,28 v9.3,27.4 | v21,9.5 21.65,9.5 R35.2
  Top 0.406: C32.1 10.35,31.35 11.8,31.35 R39.2 R40.2
  Top 1.016: C32.1 10,29.48 L1.2
  Bottom 0.4: v43.7,12.9 43.8,13 39.7,13 37.1,10.4 27.5,10.4 26.2,9.1 23.9,9.1 23.5,9.5 v21,9.5 15,9.5 13,11.5 9.5,11.5 8.8,12.2 v8.8,17.1 8.6,17.3 8.6,23.7 9.3,24.4 v9.3,27.4
+9V  (via drill 0.5 pad 1)
  Top 0.25: R7.2 32.05,31.9 v33.5,31.9 | 22.75,46.2 v21.4,46.2 | C23.1 17.3,54.5 v17.4,54.4
  Top 0.254: C33.1 20.85,31.16 U5.3 U5.2 19.14,30.66 19.2,30.6 | R1.2 26.5,25.2 v23.6,28.1
  Top 0.406: C33.1 19.54,31.04 v19.6,31
  Bottom 0.406: v23.6,28.1 23.6,28.2 20.8,31 v19.6,31
  Bottom 1: v33.5,31.9 31.8,33.6 v31.8,35.9 | v17.4,54.4 17.4,58.2 v18.9,59.7
  Bottom 1.016: v21.4,46.2 23.8,48.6 v24,48.6
  pour Top: 0.1,0.1 0.1,71.9 51.8,71.9 53.9,71.9 53.9,0 0,0
AN1
  Top 0.25: 20.9,26.4 20.9,27.1 23.8,30 TP2.TP | VR1.3 21.85,18.15 U2.7
  Top 0.254: C10.1 TP2.TP | VR1.3 21.85,21.85 20.9,22.8 20.9,26.4
AN2  (via drill 0.5 pad 1)
  Top 0.25: C1.1 44.5,41 TP1.TP 44,36.2 41.2,33.4 v41.2,22 | 29.1,16.9 U2.10 | 29,18.5 32.1,18.5 32.7,19.1 32.7,20.5 33.8,21.6 38.6,21.6 v39,22
  Top 0.254: U2.10 29,18.5 29,20.1 VR2.3
  Bottom 0.25: v39,22 v41.2,22
BAT+
  Top 1: JP1.2 31.8,58.97 J2.2
BAT-
  Bottom 0.4: J1.R 12.85,32 | 12.85,32 J1.RN | 12.85,32 5.6,32 3.8,33.8 3.8,37.2 4.9,38.3 4.9,41.2 2.3,43.8 2.3,51.5 2.7,51.9 11.6,51.9 13,50.5 18.7,50.5 | 26.6,58.4 J2.1
  Bottom 0.406: J2.1 26.9,58.3 26.4,58.3 24.9,56.8 22.9,56.8 21.8,55.7 21.8,53.2 19.1,50.5 18.7,50.5
  Bottom 1: J2.1 27,58 29.77,55.23 JP1.1
BIAS  (via drill 0.5 pad 1)
  Top 0.25: C16.2 21,12.8 21.7,12.1 v33.7,12.1 | R18.1 v33.7,15 C17.2
  Top 0.254: RV1.2 18.65,13.1 R17.1 C16.2
  Bottom 0.25: v33.7,15 v33.7,12.1
DCIN  (via drill 0.5 pad 1)
  Top 1.016: v27,69.5 CF1.1
  Bottom 1.016: J2.3 v27,69.5
FXIN
  Top 0.25: R8.2 5.15,30.02 C6.1 4.1,30 3.3,29.2 3.3,11.8 3.4,11.8 4.9,10.3 11.2,10.3 14,7.5 14,4 14.6,3.4 JP2.1
FXOUT
  Top 0.254: R38.2 27.55,5.75 26.8,6.5 26.8,8.2 27.7,9.1 27.8,9.1 C30.2
  Top 0.406: JP2.4 28.27,4.98 R38.2
G1
  Top 0.254: C12.2 TP3.TP 17,18 U2.4 17,16.1 17.4,15.7 17.4,15.05 R17.2
G2
  Top 0.254: 38,18.8 C13.1 | U2.14 37,16.1 36.7,15.8 36.7,15.05 R18.2
  Top 0.4: U2.14 37,17.9 38,18.9 C13.1
GND  (via drill 0.5 pad 1)
  Top 0.25: R15.1 v37.6,42.6 | R32.1 v32,5.9 | C23.2 v12.8,54.5 | U5.6 16.55,33.2 R41.1 16.4,33.2 v17.7,33.2 | U5.1 18.55,29.65 v18.5,29.2 | v37.65,13.7 38,14 C15.2 | R30.1 26.1,47.5 v25.9,47.7 | R10.1 14.25,24.6 v15.4,24.6
  Top 0.4: U4.3 44.75,27 C31.2 43.4,27.1 v43.4,28.4 | C5.1 v35.5,26.2 | R12.1 38.05,31.8 v39.3,31.8 | R36.1 v50,30.1 | R11.1 29.95,31.8 29.2,31.8 28.9,31.6 v28.6,31.6 | D3.2 19.88,62 19.1,62 18.7,61.6 v18,61.6 | C14.1 v15,13.4 | RV1.3 17.8,7.2 v16.4,7.2 | C19.1 48.3,15.07 v48.3,16.3 | C3.2 v39.5,54.6 | 36.5,48.99 U1.4 36.4,48.4 v36.8,48 | C27.1 4.8,45.38 v4.8,44.8 | U3.4 10.3,48.5 v8.5,48.5 | C33.2 21.17,34.37 v21.2,34.6 | 23.1,15.1 C16.1 | C4.1 26.5,17.5 U2.9 | R31.1 v38,5.9 | C18.1 5.62,19.01 J1.SN | R8.1 6.85,35.77 J1.S | C32.2 v10,34.4
  Top 0.406: R38.1 25.85,3.52 JP2.3
  Top 1: v11.4,68.7 11.4,67 C22.- 11.3,66.5 v11.3,65.5 | CF1.2@1 CF1.2@2 v19,67.2 | C21.2 v18,61.6 | U2.8 25,15.7 24.4,15.1 23.1,15.1
  Top 1.016: C17.1 27.7,15 27,15.7 U2.9
  pour Bottom: 0,-0.1 54.1,-0.1 54.1,63.8 45.9,72 7.9,72 -0.1,64 -0.1,0
JACKIN
  Top 0.406: JP2.2 23.19,5.77 FB1.2
JACKOUT
  Top 1: JP2.6 FB2.1
K1
  Top 0.254: 11,15.15 R20.2
  Top 0.4: C14.2 U2.2 | 11,15.15 U2.1
  Top 1: U2.1 U2.2
K2
  Top 0.254: 43,15.15 R21.2
  Top 0.4: C15.1 U2.16 | 43,15.15 U2.17
  Top 1: U2.16 U2.17
LED
  Top 0.25: JP2.5 30.81,1.71 30.4,1.3 2.6,1.3 1.2,2.7 1.2,35.4 5.9,40.1 18.4,40.1 23.77,34.73 LED1.K
MIX  (via drill 0.5 pad 1)
  Top 0.25: R26.2 17.75,49.45 18.1,49.8 21,49.8 25.3,45.5 v25.6,45.5
  Top 0.254: U3.5 15.7,48.5 R26.2
  Bottom 0.25: v25.6,45.5 32.2,38.9 41.2,38.9 41.7,39.4 41.7,42.8 41,43.5 MIX.P$2
N$1
  Top 0.254: C10.2 29.85,30 R11.2 R7.1 32.25,29.9 T2.B
N$2
  Top 0.25: C6.2 6.88,28.02 R5.1
N$3
  Top 0.25: C13.2 40,28.15 R12.2
  Top 0.254: T2.E 36.2,30.15 R12.2
N$4  (via drill 0.5 pad 1)
  Top 0.25: FB1.1 15.58,10.42 13.5,12.5 v4.6,12.5 | J1.T 16.61,38.7 6,38.7 2.4,35.1 2.4,10.6 v2.6,10.4
  Bottom 0.25: v2.6,10.4 v4.6,12.5
N$6
  Top 0.254: T1.E 11.7,22.65 R10.2 14.85,22.65 15.8,23.6 16.98,23.6 C7.1
N$7
  Top 0.25: R5.2 R4.1 5.1,25.95 5.1,24.3 7,22.4 T1.B
N$8  (via drill 0.5 pad 1)
  Top 0.25: v28.5,33.6 25.6,33.6 20.8,28.8 19.6,28.8 17,26.2 C7.2 | 34.6,44.2 34.3,44.5 R9.1 33.8,44.5 32.2,46.1 30.6,46.1 29.3,44.8 29.3,38.3 v29.2,38.2
  Bottom 0.25: v28.5,33.6 29.2,34.3 v29.2,38.2
N$9
  Top 0.25: R6.1 36.45,46.6 37.5,46.6 37.8,46.9 37.8,47.4 38.3,47.9 38.3,48.45
  Top 0.254: R6.1 R9.2 | U1.3 37.84,50.37 38.3,49.9 38.3,48.45
N$10
  Top 0.25: 21.15,53.3 23.35,53.3 R16.1
  Top 0.254: 21.15,53.3 D1.2
N$11  (via drill 0.5 pad 1)
  Top 0.25: v13.4,53.1 13.4,50.5 12.5,49.6 12.5,47.9 12,47.4 9.7,47.4 8.4,46.1 8.4,45.5 7.3,44.4 6.4,44.4 S1.3 | D1.1 20.4,55.45 | 20.4,55.45 19.65,55.45 19.4,55.2 v19.4,53.3 | R14.1 26.75,55.35 26.3,55.8 20.75,55.8 20.4,55.45
  Top 0.254: D1.1 D2.2
  Bottom 0.25: v13.4,53.1 14.1,52.4 18.5,52.4 v19.4,53.3
N$12
  Top 0.25: D1.3 24.95,54.5 R14.2
N$13  (via drill 0.5 pad 1)
  Top 0.25: C12.1 19.1,22 20.1,23 20.1,27.1 25.6,32.6 28.8,32.6 29.6,33.4 37.4,33.4 C20.1 | 38.5,37.5 38.5,47.1 39.3,47.9 39.3,48.2 | 37.9,60 37,60 35.5,58.5 35.5,55 33.48,52.98 C11.2 27.8,52.98 | 27.8,52.98 25.38,52.98 R16.2 | D2.1 24.15,58.95 24.4,58.7 24.4,57.2 25,56.6 27,56.6 27.8,55.8 27.8,52.98 | U1.1 36.4,53.6 v36.9,54.1
  Top 0.254: C20.1 38.5,37.5 | 39.3,48.2 39.3,51.8 38.2,52.91 36.61,52.91 | 36.61,52.91 U1.1 | D2.1 20.95,59 | 38.8,62.5 GAIN.P$3 | 36.61,52.91 36.6,52.91
  Top 1: GAIN.P$3 GAIN.P$2 37.9,60
  Bottom 0.25: v36.9,54.1 36.7,54.1 36.7,59.1 37.6,60 GAIN.P$2
N$14  (via drill 0.5 pad 1)
  Top 0.25: C8.2 36.5,38.38 36.5,35.4 35.7,34.6 30.1,34.6 28.7,36 24.5,36 18.8,41.7 12.3,41.7 S1.2 | C9.2 35.5,40.88 v35.5,41.3 | v33,46.6 32.4,47.2 C11.1 32.77,51.6 34.7,51.6 | R19.1 36.9,55.5 34.7,53.3 34.7,51.6 | 34.7,51.6 36.8,51.6 36.9,51.5 36.53,51.5 U1.2
  Top 0.254: C8.2 C9.2
  Bottom 0.25: v35.5,41.3 35.5,45.1 35.1,45.5 34.1,45.5 v33,46.6
N$15
  Top 0.254: U5.7 15.84,31.66 TP5.TP | 14.85,32.65 TP5.TP | R40.1 14.05,32.3 TP5.TP
N$17
  Top 0.25: 37.15,57.5 R19.2
  Top 1: GAIN.P$1 37.15,57.5
N$18
  Top 0.25: R34.1 47.82,24.53 U4.1 49.77,26.92 R36.2
N$19
  Top 0.25: R37.2 LED1.A
N$20
  Top 0.254: R13.2 33.25,38.3 C8.1
N$21
  Top 0.254: 20.25,7.35 RV1.1
  Top 0.4: R35.1 20.25,7.15 RV1.1
N$22
  Top 0.25: R15.2 34.3,42.15 34.3,41 34.52,40.77 C9.1
  Top 0.254: R13.1 33.25,40.1 C9.1
N$23
  Top 0.25: 15.84,30.66 14.96,30.66 14.9,30.6
  Top 0.254: U5.9 15.84,30.66
  Top 0.4: 14.9,30.6 14.9,30.5 14.6,30.2
  Top 0.406: 14.6,30.2 14.6,28.07 L1.1
N$24
  Top 0.25: R3.2 42.65,47.65 42.1,48.2 42.1,49 42.2,49.1 U1.5
  Top 0.254: R3.2 42.65,43.15 C1.2
N$25
  Top 0.25: U1.7 44.13,51.63 C2.1
  Top 0.254: U1.6 U1.7 | 44.37,51.63 C2.1
N$26
  Top 0.254: C20.2 MIX.P$1
N$27  (via drill 0.5 pad 1)
  Top 0.25: C2.2 44.4,49 43.7,48.3 v43.4,48.3
  Bottom 0.25: v43.4,48.3 40.7,48.3 40,47.6 MIX.P$3
N$28
  Top 0.25: U3.3 11.87,49.87 12.2,50.2 12.2,53.2 11.6,53.8 11.6,55 12.7,56.1 17.3,56.1 18.5,54.9 18.5,52.6 18.8,52.3 21.9,52.3 23.2,51 TONE.P$1 24.4,50.9 | C27.2 7.28,47.88 R23.2
  Top 0.254: U3.3 10.37,49.9 8.7,49.9 8.3,49.5 R22.1 R23.2 7.38,47.48
N$29
  Top 0.25: C24.1 3.4,43.6 4.6,42.4 7.5,42.4 8.1,43 8.1,44.4 10.2,46.5 12.4,46.5 13.3,47.4 13.3,49.2 14,49.9 15.56,49.9 U3.6
  Top 0.254: U3.7 U3.6
N$30
  Top 0.4: R23.1 3.6,47.7 C24.2
N$31
  Top 0.254: C25.1 5.9,58.5 5.5,58.1 R33.2 7.47,52.85 C29.2 8.22,52.88 8.7,52.4 U3.1
N$32
  Top 0.25: R27.1 2.35,52.85 1.6,52.1 1.6,43.6 3.8,41.4 7.9,41.4 8.9,42.4 8.9,44.4 10.4,45.9 15.3,45.9 16.9,44.3 18.3,44.3 19.2,45.2 19.2,45.8 20.7,47.3 22.5,47.3 25.5,44.3 27.8,44.3 30,46.5 30,50.5 TONE.P$3
N$33
  Top 0.254: C28.2 27,49.12 TONE.P$2
N$34
  Top 0.254: C28.1 28.85,48.98 R30.2
N$35
  Top 0.254: U3.2 C29.1 7.47,51.15 R33.1 R27.2
N$36
  Top 0.254: C25.2 R25.1
N$37
  Top 0.254: R25.2 13.35,57.5 VOL.P$3
N$38
  Top 0.25: 45.3,61.2 45.5,61.2 50.4,61.2 51.7,59.9 51.7,13.7 51.1,13.1 46.8,13.1 45.05,11.35 42.35,11.35 C26.1 | 31.7,65.3 29.6,67.4 24.7,67.4 22.8,65.5 22.8,62.4 21.1,60.7 18.4,60.7 17.7,60 VOL.P$2
  Top 0.254: 31.7,65.3 32.4,64.6 41.1,64.6 44.5,61.2 45.5,61.2
N$39
  Top 0.25: C26.2 R24.1
  Top 0.254: R24.1 R31.2 36.2,8.85 T3.B
N$40
  Top 0.254: T3.E 33.8,8.85 R32.2 R29.1
N$41
  Top 0.254: R29.2 28.15,7.15 C30.1
OUT  (via drill 0.5 pad 1)
  Top 0.25: FB2.2 40.7,3.4 42.8,1.3 46.9,1.3 49.6,4 49.6,7 v46.6,10 46.5,10.1
  Bottom 0.25: v46.6,10 45.8,11.2 45.8,18.2 45.3,18.7 37.38,18.7 36.2,19.89 J3.T
RL1
  Top 0.254: VR1.1 24.15,21.45 25.4,22.7 | 25.4,22.7 25.6,22.9 26.45,22.9 R1.1 | VR1.2 23,25.1 25.4,22.7
RL2
  Top 0.254: R2.1 30.35,26.1 VR2.2 30.1,25.65 30.1,24.5 31.15,23.45 VR2.1
VCC3
  Top 0.25: U5.5 18.55,32.45 18.9,32.8 18.9,33.7 18.2,34.7 16.65,34.7 | R39.1 12.15,32.65 | 14,34.7 TP4.TP 16.65,34.7 | 16.65,34.7 R41.2
  Top 0.254: 12.15,32.65 12,32.8 12,33.1 12.1,33.2 12.1,33.5 13.3,34.7 14,34.7

### Text on the board
_tsilk: C22 | CF1 | D3 | C21 | C25 | D2 | R25 | D1 | R19 | C23 | R14 | JP1 | C3 | R27 | R33 | C29 | U3 | C11 | U1 | R16 | C2 | R22 | R26 | C28 | R23 | R30 | C24 | R6 | R3 | C27 | R9 | R37 | C1 | R15 | C9 | TP4 | C8 | TP1 | R13 | C20 | R41 | R39 | R40 | C32 | C33 | R11 | R7 | T2 | R8 | R28 | TP2 | C6 | U5 | C10 | R12 | U4 | R36 | R5 | R2 | R4 | L1 | C7 | R1 | C5 | C31 | R34 | T1 | R10 | VR2 | VR1 | C12 | C4 | C13 | TP3 | R21 | C18 | R20 | C14 | R17 | C16 | C17 | R18 | C15 | C19 | FB1 | R35 | C30 | R29 | R32 | R31 | C26 | RV1 | T3 | R24 | R38 | JP2 | FB2